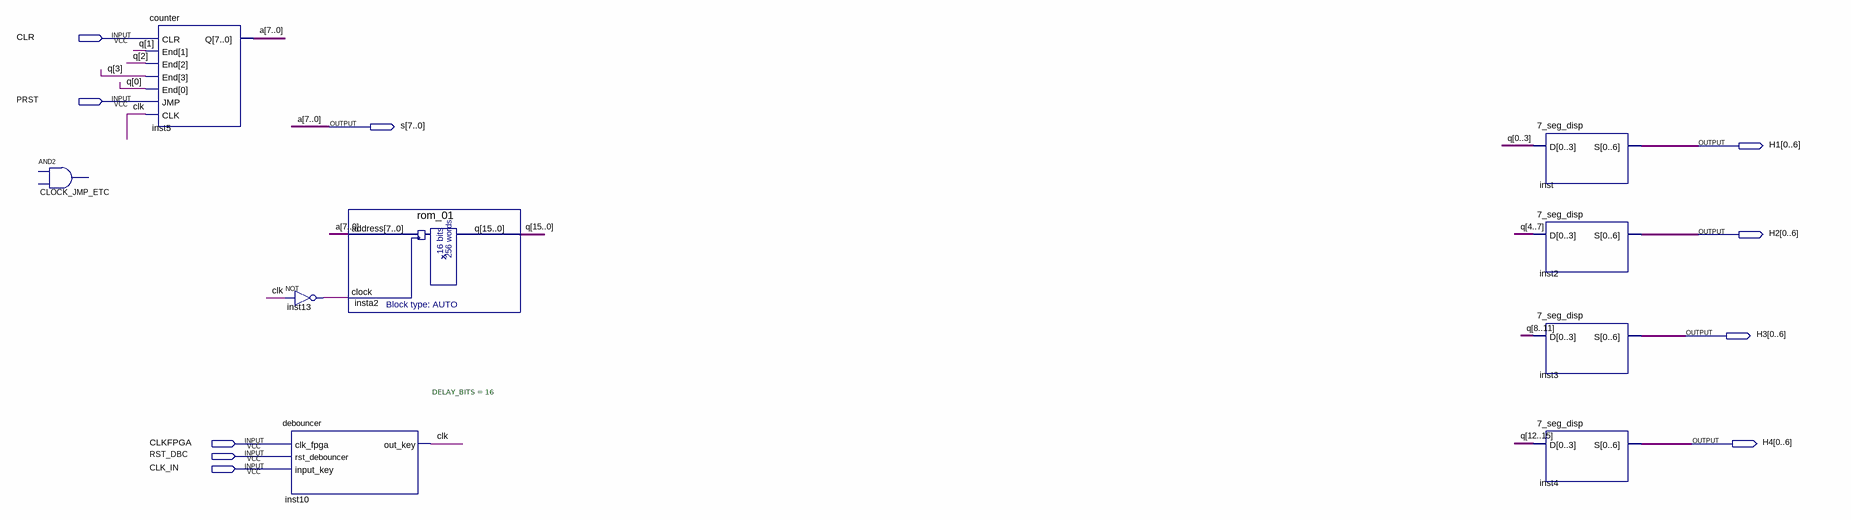
[diagram p0: schematic sheet]
// Quartus schematic memoria.bdf as structural Verilog: 9 symbols, 10 pins
module memoria (
  input  CLR,
  input  PRST,
  input  CLKFPGA,
  input  RST_DBC,
  input  CLK_IN,
  output [7:0] s,
  output [0:6] H1,
  output [0:6] H2,
  output [0:6] H3,
  output [0:6] H4
);

  wire clk, inst13_out;
  wire [15:0] q;

  // AND2 CLOCK_JMP_ETC is placed but not wired
  counter inst5 (.CLR(CLR), .End(q[3:0]), .JMP(PRST), .CLK(clk), .Q(s));
  not inst13 (inst13_out, clk);
  debouncer #(.DELAY_BITS(16)) inst10 (.clk_fpga(CLKFPGA), .rst_debouncer(RST_DBC), .input_key(CLK_IN), .out_key(clk));
  rom_01 insta2 (.address(s), .clock(inst13_out), .q(q));
  \7_seg_disp  inst (.D({q[0], q[1], q[2], q[3]}), .S(H1));
  \7_seg_disp  inst2 (.D({q[4], q[5], q[6], q[7]}), .S(H2));
  \7_seg_disp  inst3 (.D({q[8], q[9], q[10], q[11]}), .S(H3));
  \7_seg_disp  inst4 (.D({q[12], q[13], q[14], q[15]}), .S(H4));

  // Other names for the same wires on the sheet: a[7:0] = s
endmodule
